# Altium schematic sheet BK5811.SchDoc
size A4
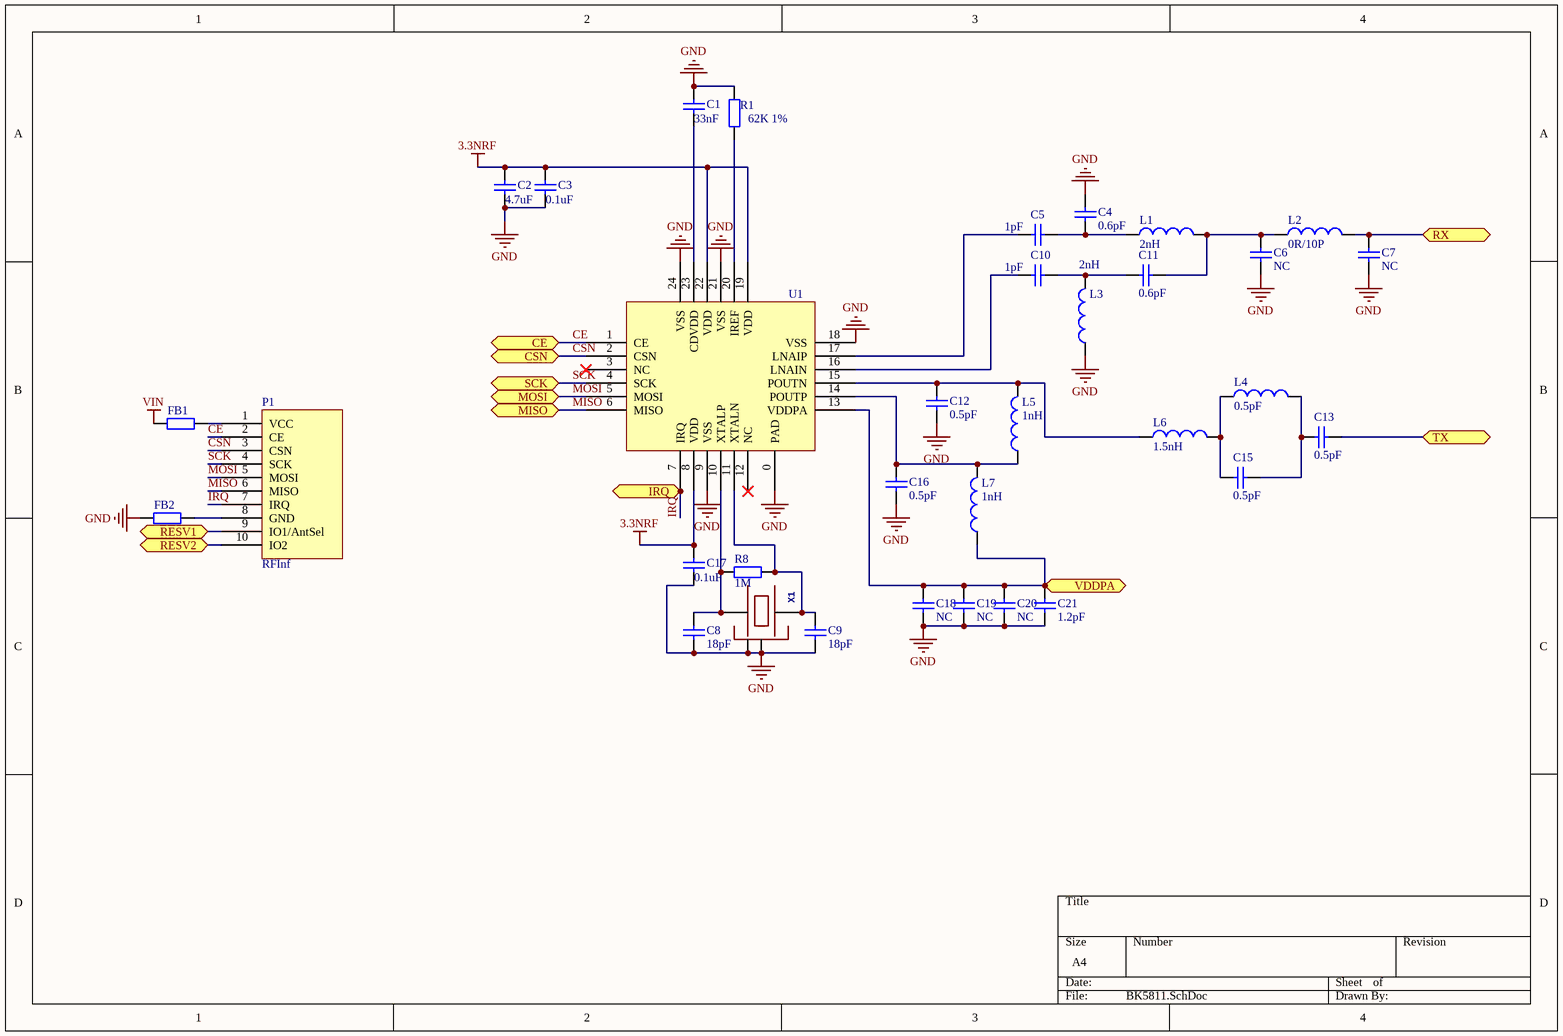
[diagram p0: BK5811.SchDoc]

## Parts
C1  33nF  [0402]
C2  4.7uF  [0603]
C3  0.1uF  [0402]
C4  0.6pF  [0402]
C5  1pF  [0402]
C6  NC  [0402]
C7  NC  [0402]
C8  value 18pF  [0402]  (hidden comment: Cap)
C9  value 18pF  [0402]  (hidden comment: Cap)
C10  1pF  [0402]
C11  0.6pF  [0402]
C12  0.5pF  [0402]
C13  0.5pF  [0402]
C15  0.5pF  [0402]
C16  0.5pF  [0402]
C17  0.1uF  [0402]
C18  NC  [0402]
C19  NC  [0402]
C20  NC  [0402]
C21  1.2pF  [0402]
FB1  Res2  [0402]  (value not drawn)
FB2  Res2  [0402]  (value not drawn)
L1  2nH  [0402]
L2  0R/10P  [0402]
L3  2nH  [0402]
L4  0.5pF  [0402]
L5  1nH  [0402]
L6  1.5nH  [0402]
L7  1nH  [0402]
P1  RFInf  [RFInf - SINGLESIDE]
R1  62K 1%  [0402]
R8  value 1M  [0402]  (hidden comment: Res2)
U1  BK5811  [BK5811]  (value not drawn)
X1  16Mhz  [OSCILLATOR-3.2X2.5]  (value not drawn)

## Ports
CE, CSN, IRQ, MISO, MOSI, RESV1, RESV2, RX, SCK, TX, VDDPA

## Nets
3.3NRF: C2.2 C3.2 C17.2 U1.8(VDD) U1.19(VDD) U1.22(VDD)
GND: C1.2 C2.1 C3.1 C4.2 C6.1 C7.1 C8.2 C9.2 C12.1 C16.1 C17.1 C18.2 C19.2 C20.2 C21.2 FB2.1 L3.1 R1.2 U1.0(PAD) U1.9(VSS) U1.18(VSS) U1.21(VSS) U1.24(VSS) X1.2(NC_2) X1.4(NC_4)
VIN: FB1.1
CE: P1.2(CE) U1.1(CE) ; port CE
CSN: P1.3(CSN) U1.2(CSN) ; port CSN
IRQ: P1.7(IRQ) U1.7(IRQ) ; port IRQ
MISO: P1.6(MISO) U1.6(MISO) ; port MISO
MOSI: P1.5(MOSI) U1.5(MOSI) ; port MOSI
RESV1: P1.9(IO1/AntSel) ; port RESV1
RESV2: P1.10(IO2) ; port RESV2
RX: C7.2 L2.2 ; port RX
SCK: P1.4(SCK) U1.4(SCK) ; port SCK
TX: C13.2 ; port TX
VDDPA: C18.1 C19.1 C20.1 C21.1 L7.1 U1.13(VDDPA) ; port VDDPA
NetC1_1: C1.1 U1.23(CDVDD)
NetC4_1: C4.1 C5.2 L1.1
NetC5_1: C5.1 U1.17(LNAIP)
NetC6_2: C6.2 C11.1 L1.2 L2.1
NetC8_1: C8.1 R8.2 U1.10(XTALP) X1.1
NetC9_1: C9.1 R8.1 U1.11(XTALN) X1.3
NetC10_1: C10.1 U1.16(LNAIN)
NetC10_2: C10.2 C11.2 L3.2
NetC12_2: C12.2 L5.2 L6.1 U1.15(POUTN)
NetC13_1: C13.1 C15.2 L4.2
NetC15_1: C15.1 L4.1 L6.2
NetC16_2: C16.2 L5.1 L7.2 U1.14(POUTP)
NetFB1_2: FB1.2 P1.1(VCC)
NetFB2_2: FB2.2 P1.8(GND)
NetR1_1: R1.1 U1.20(IREF)

Not connected (* = marked no-connect by the designer): U1 3(NC)* 12(NC)*

## Library data of the parts
C1-C13 C15-C21 = Cap: Capacitor; Published: 8-Jun-2000; LatestRevisionDate: 17-Jul-2002; LatestRevisionNote: Re-released for DXP Platform.; PackageReference: RAD-0.3; Publisher: Altium Limited; PackageDescription: Radial Cap, Thru-Hole; 2 Leads; 0.3 in Pin Spacing
FB1 FB2 = Res2: Resistor; Value: FB; Published: 8-Jun-2000; LatestRevisionDate: 17-Jul-2002; LatestRevisionNote: Re-released for DXP Platform.; PackageReference: AXIAL-0.4; Publisher: Altium Limited; PackageDescription: Axial Device, Thru-Hole; 2 Leads; 0.4 in Pin Spacing
L1-L7 = Inductor: Code_IEC: 1005; Published: 8-Jun-2000; LatestRevisionDate: 29-May-2009; LatestRevisionNote: IPC-7351 Footprint Added.; PackageReference: 0402-A; Publisher: Altium Limited; PackageDescription: Chip Inductor; Code_JEITA: 0402
R1 R8 = Res2: Resistor; Published: 8-Jun-2000; LatestRevisionDate: 17-Jul-2002; LatestRevisionNote: Re-released for DXP Platform.; PackageReference: AXIAL-0.4; Publisher: Altium Limited; PackageDescription: Axial Device, Thru-Hole; 2 Leads; 0.4 in Pin Spacing
X1 = OSCILLATOR-3.2X2.5: Crystal Oscillator in 3.2x2.5 SMD